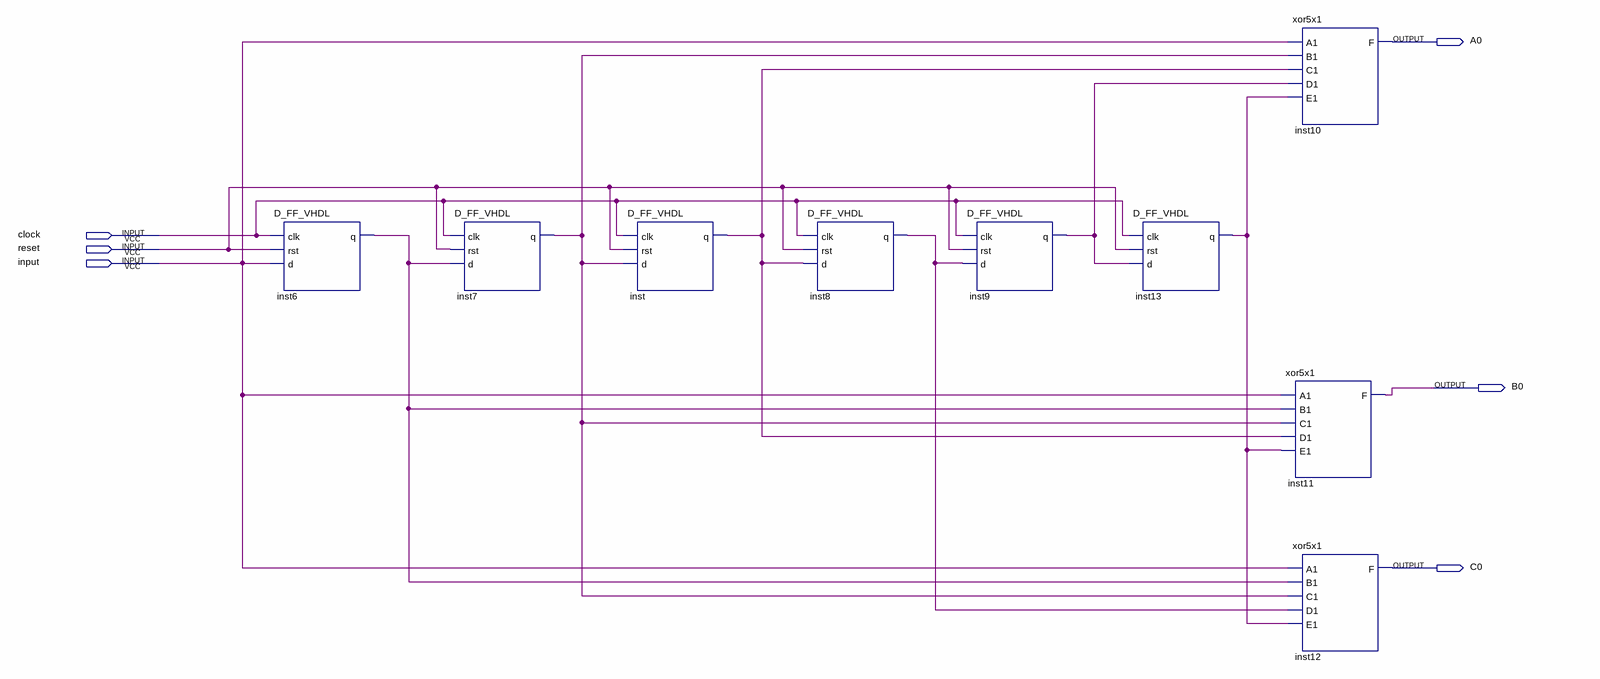
[diagram p0: schematic sheet]
// Quartus schematic ccEncoder.bdf as structural Verilog: 9 symbols, 6 pins
module ccEncoder (
  input  clock,
  input  reset,
  input  \input ,
  output A0,
  output B0,
  output C0
);

  wire inst6_q, inst7_q, inst8_q, inst9_q, inst13_q, inst_q;

  D_FF_VHDL inst6 (.clk(clock), .rst(reset), .d(\input ), .q(inst6_q));
  D_FF_VHDL inst7 (.clk(clock), .rst(reset), .d(inst6_q), .q(inst7_q));
  D_FF_VHDL inst (.clk(clock), .rst(reset), .d(inst7_q), .q(inst_q));
  D_FF_VHDL inst8 (.clk(clock), .rst(reset), .d(inst_q), .q(inst8_q));
  D_FF_VHDL inst9 (.clk(clock), .rst(reset), .d(inst8_q), .q(inst9_q));
  D_FF_VHDL inst13 (.clk(clock), .rst(reset), .d(inst9_q), .q(inst13_q));
  xor5x1 inst10 (.A1(\input ), .B1(inst7_q), .C1(inst_q), .D1(inst9_q), .E1(inst13_q), .F(A0));
  xor5x1 inst11 (.A1(\input ), .B1(inst6_q), .C1(inst7_q), .D1(inst_q), .E1(inst13_q), .F(B0));
  xor5x1 inst12 (.A1(\input ), .B1(inst6_q), .C1(inst7_q), .D1(inst8_q), .E1(inst13_q), .F(C0));
endmodule
